# EAGLE design DFPlayer (EAGLE 9.6.2)
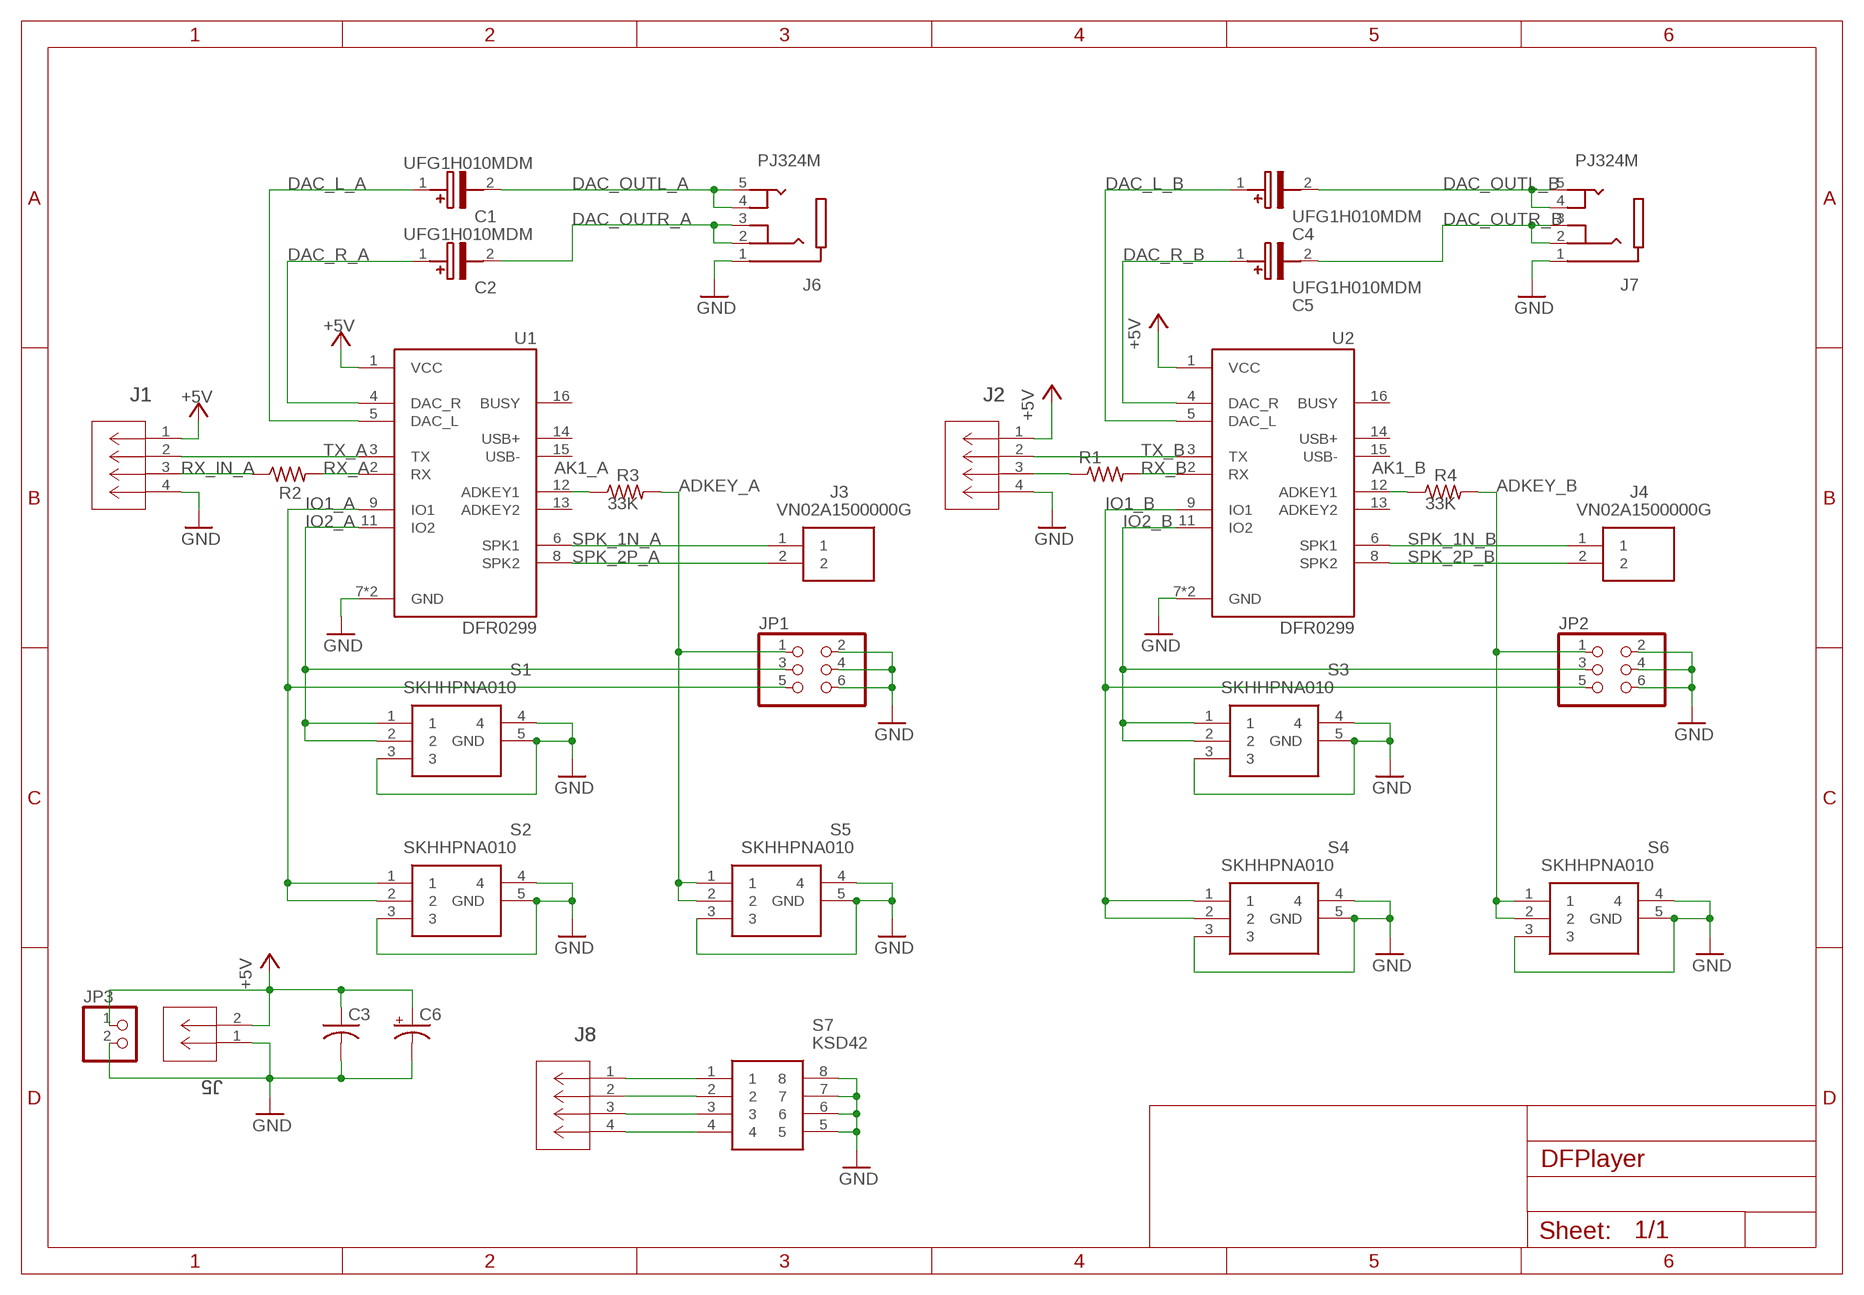
[diagram p0: schematic, sheet 1]

## Parts
C1  UFG1H010MDM  [CAPPRD200W60D550H1250]
C2  UFG1H010MDM  [CAPPRD200W60D550H1250]
C3  C-US025-024X044  [C025-024X044]
C4  UFG1H010MDM  [CAPPRD200W60D550H1250]
C5  UFG1H010MDM  [CAPPRD200W60D550H1250]
C6  CPOL-USB45181A  [B45181A]
J1  S4B-PH-K-S(LF)(SN)  [CONN_S4B-PH-K-S_JST]
J2  S4B-PH-K-S(LF)(SN)  [CONN_S4B-PH-K-S_JST]
J3  VN02A1500000G  [VN02A1500000G]
J4  VN02A1500000G  [VN02A1500000G]
J5  S2B-PH-K-S(LF)(SN)  [CONN_S2B-PH-K-S_JST]
J6  PJ324M  [WENZHOU_PJ324M]
J7  PJ324M  [WENZHOU_PJ324M]
J8  S4B-PH-K-S(LF)(SN)  [CONN_S4B-PH-K-S_JST]
JP1  PINHD-2X3  [2X03]
JP2  PINHD-2X3  [2X03]
JP3  PINHD-1X2  [1X02]
R1  R-US_0204/7  [0204/7]
R2  R-US_0204/7  [0204/7]
R3  R-US_0204/7  [0204/7]
R4  R-US_0204/7  [0204/7]
S1  SKHHPNA010  [SKHHPJA010]
S2  SKHHPNA010  [SKHHPJA010]
S3  SKHHPNA010  [SKHHPJA010]
S4  SKHHPNA010  [SKHHPJA010]
S5  SKHHPNA010  [SKHHPJA010]
S6  SKHHPNA010  [SKHHPJA010]
S7  KSD42  [DIP815W60P254L1210H450Q8N]
U1  DFR0299  [MODULE_DFR0299]
U2  DFR0299  [MODULE_DFR0299]

## Nets
+5V: C3.1 C6.+ J1.1 J2.1 J5.2 JP3.1 U1.1(VCC) U2.1(VCC)
ADKEY_A: JP1.1 R3.2 S5.1 S5.2
ADKEY_B: JP2.1 R4.2 S6.1 S6.2
AK1_A: R3.1 U1.12(ADKEY1)
AK1_B: R4.1 U2.12(ADKEY1)
DAC_L_A: C1.1(+) U1.5(DAC_L)
DAC_L_B: C4.1(+) U2.5(DAC_L)
DAC_OUTL_A: C1.2(-) J6.4(TIP_1) J6.5(TIP_2)
DAC_OUTL_B: C4.2(-) J7.4(TIP_1) J7.5(TIP_2)
DAC_OUTR_A: C2.2(-) J6.2(RING_1) J6.3(RING_2)
DAC_OUTR_B: C5.2(-) J7.2(RING_1) J7.3(RING_2)
DAC_R_A: C2.1(+) U1.4(DAC_R)
DAC_R_B: C5.1(+) U2.4(DAC_R)
GND: C3.2 C6.- J1.4 J2.4 J5.1 J6.1(SLEEVE) J7.1(SLEEVE) JP1.2 JP1.4 JP1.6 JP2.2 JP2.4 JP2.6 JP3.2 S1.3 S1.4 S1.5(GND) S2.3 S2.4 S2.5(GND) S3.3 S3.4 S3.5(GND) S4.3 S4.4 S4.5(GND) S5.3 S5.4 S5.5(GND) S6.3 S6.4 S6.5(GND) S7.5 S7.6 S7.7 S7.8 U1.7(GND) U1.10(GND) U2.7(GND) U2.10(GND)
IO1_A: JP1.5 S2.1 S2.2 U1.9(IO1)
IO1_B: JP2.5 S4.1 S4.2 U2.9(IO1)
IO2_A: JP1.3 S1.1 S1.2 U1.11(IO2)
IO2_B: JP2.3 S3.1 S3.2 U2.11(IO2)
N$1: J8.1 S7.1
N$2: J8.2 S7.2
N$3: J8.3 S7.3
N$4: J8.4 S7.4
N$8: J2.3 R1.1
RX_A: R2.2 U1.2(RX)
RX_B: R1.2 U2.2(RX)
RX_IN_A: J1.3 R2.1
SPK_1N_A: J3.1 U1.6(SPK1)
SPK_1N_B: J4.1 U2.6(SPK1)
SPK_2P_A: J3.2 U1.8(SPK2)
SPK_2P_B: J4.2 U2.8(SPK2)
TX_A: J1.2 U1.3(TX)
TX_B: J2.2 U2.3(TX)
Unconnected: U1.13(ADKEY2) U1.14(USB+) U1.15(USB-) U1.16(BUSY) U2.13(ADKEY2) U2.14(USB+) U2.15(USB-) U2.16(BUSY)

## Library data of the parts
C1 C2 C4 C5 = AU222_F:UFG1H010MDM: Nichicon 1F 50V dc Aluminium Electrolytic Capacitor, Through Hole 5 (Dia.) x 11mm +85C 5mm 2mm Source: Datasheet; DESCRIPTION: Nichicon 1F 50V dc Aluminium Electrolytic Capacitor, Through Hole 5 (Dia.) x 11mm +85C 5mm 2mm; HEIGHT: 12.5mm; MANUFACTURER_NAME: Nichicon; MANUFACTURER_PART_NUMBER: UFG1H010MDM; MOUSER_PART_NUMBER: 647-UFG1H010MDM; MOUSER_PRICE-STOCK: https://www.mouser.co.uk/ProductDetail/Nichicon/UFG1H010MDM?qs=kArNe9LFxXnnZzi8YNJV2w%3D%3D
C3 = AU222_F:C-US: CAPACITOR, American symbol; SPICEPREFIX: C
C6 = AU222_F:CPOL-US: POLARIZED CAPACITOR, American symbol; SPICEPREFIX: C
J1 J2 J8 = AU222_F:S4B-PH-K-S(LF)(SN); COPYRIGHT: Copyright (C) 2024 Ultra Librarian. All rights reserved.; DIGI-KEY_PART_NUMBER_1: 455-1721-ND; DIGI-KEY_PART_NUMBER_2: 455-1721-NDL; MANUFACTURER_PART_NUMBER: S4B-PH-K-S(LF)(SN); MFR_NAME: JST
J3 J4 = AU222_F:VN02A1500000G: 2 Position Wire to Board Terminal Block Horizontal with Board 0.100" (2.54mm) Through Hole Source: Datasheet <http://www.anytek.com.tw/UserUpFiles/20120512/L_wOt9EJEyJN.pdf>; DESCRIPTION: 2 Position Wire to Board Terminal Block Horizontal with Board 0.100" (2.54mm) Through Hole; HEIGHT: 8.8mm; MANUFACTURER_NAME: Amphenol; MANUFACTURER_PART_NUMBER: VN02A1500000G; MOUSER_PART_NUMBER: 649-VN02A15000J0G; MOUSER_PRICE-STOCK: https://www.mouser.co.uk/ProductDetail/Amphenol-Anytek/VN02A1500000G?qs=Mv7BduZupUgf8d3Xo6xdxw%3D%3D
J5 = AU222_F:S2B-PH-K-S(LF)(SN); COPYRIGHT: Copyright (C) 2024 Ultra Librarian. All rights reserved.; DIGI-KEY_PART_NUMBER_1: 455-1719-ND; DIGI-KEY_PART_NUMBER_2: 455-1719-NDL; MANUFACTURER_PART_NUMBER: S2B-PH-K-S(LF)(SN); MFR_NAME: JST
J6 J7 = AU222_F:PJ324M: Headphone Stereo jack/Audio connector Check availability <https://pricing.snapeda.com/parts/PJ324M/Wenzhou%20QingPu%20Electronics%20Co.Ltd/view-part?ref=eda>; AVAILABILITY: Not in stock; CHECK_PRICES: https://www.snapeda.com/parts/PJ324M/Wenzhou+QingPu+Electronics+Co.Ltd/view-part/?ref=eda; DESCRIPTION: Headphone Stereo jack/Audio connector; MF: Wenzhou QingPu Electronics Co.Ltd; MP: PJ324M; PACKAGE: Package; PRICE: None; SNAPEDA_LINK: https://www.snapeda.com/parts/PJ324M/Wenzhou+QingPu+Electronics+Co.Ltd/view-part/?ref=snap
JP1 JP2 = AU222_F:PINHD-2X3: PIN HEADER
JP3 = AU222_F:PINHD-1X2: PIN HEADER
R1-R4 = AU222_F:R-US_: RESISTOR, American symbol; SPICEPREFIX: R
S1-S6 = AU222_F:SKHHPNA010: Black Cap Tactile Switch, SPST-NO 50 mA 5.9mm Snap-In Source: Datasheet <https://www.alps.com/prod/info/E/HTML/Tact/SnapIn/SKHH/SKHHPNA010.html>; DESCRIPTION: Black Cap Tactile Switch, SPST-NO 50 mA 5.9mm Snap-In; HEIGHT: mm; MANUFACTURER_NAME: ALPS Electric; MANUFACTURER_PART_NUMBER: SKHHPNA010; MOUSER_PART_NUMBER: 688-SKHHPN; MOUSER_PRICE-STOCK: https://www.mouser.co.uk/ProductDetail/Alps-Alpine/SKHHPNA010?qs=seHrhfPpLDzVrQJIgDXcJQ%3D%3D
S7 = AU222_F:KSD42: DIP switch K series slide type Source: Datasheet; DESCRIPTION: DIP switch K series slide type; HEIGHT: 4.5mm; MANUFACTURER_NAME: Otax; MANUFACTURER_PART_NUMBER: KSD42
U1 U2 = AU222_F:DFR0299: Dfplayer - a Mini Mp3 Player; AVAILABILITY: Unavailable; DESCRIPTION: Dfplayer - a Mini Mp3 Player; MF: DFRobot; MP: DFR0299; PACKAGE: None; PRICE: None

## Board
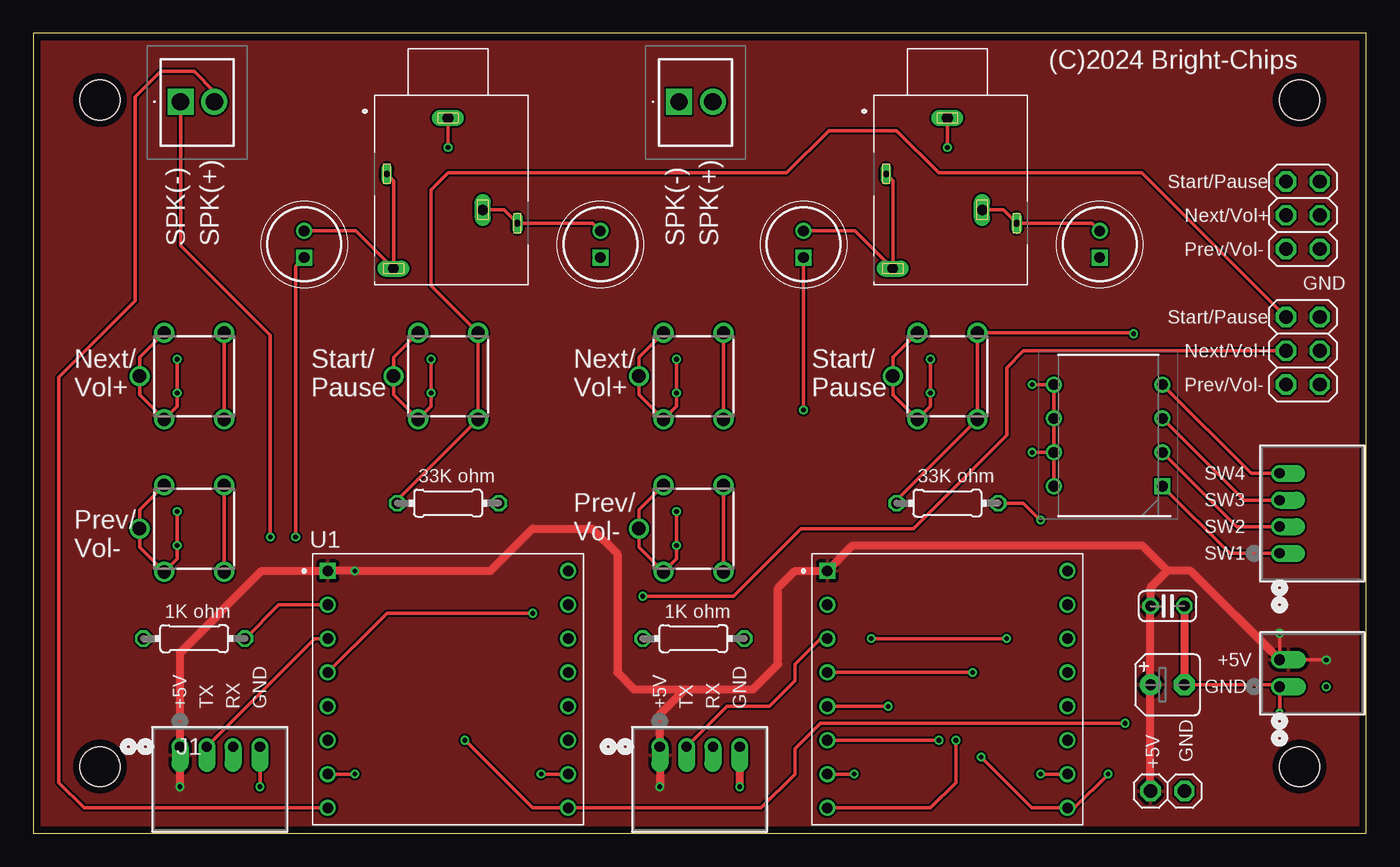
[diagram p1: board, top side]
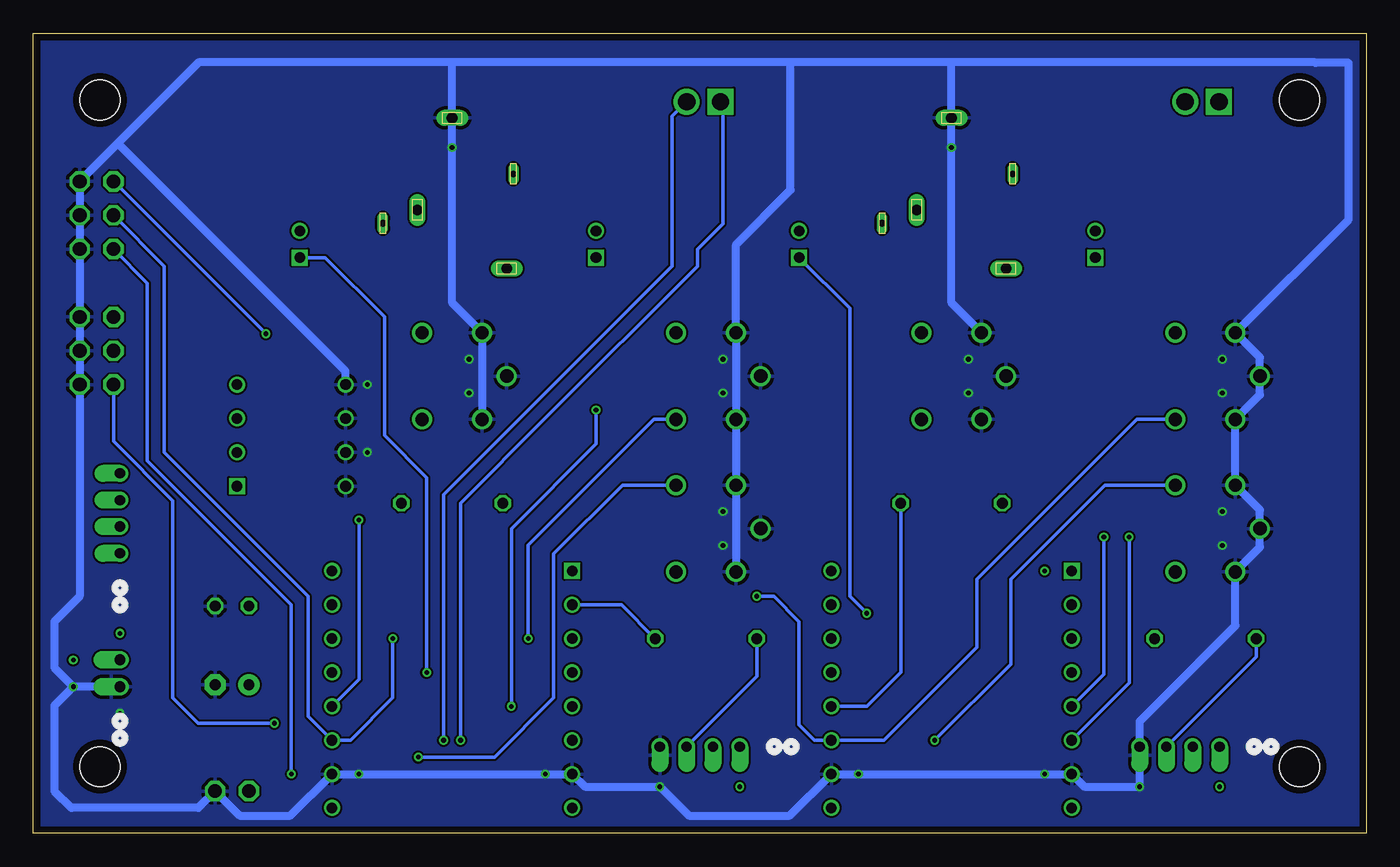
[diagram p2: board, bottom side, seen from below]

Size 100 x 60 mm. Coordinates in mm from the lower left corner, seen from the top.
Outline: 0,0 100,0 100,60 0,60 0,0
Copper layers (1*16): Top 0.035mm / dielectric 1.6mm / Bottom 0.035mm
Design rules "Elecrow_2-layer_PCB_eagle_rule": minimum track width 6mil, minimum drill 12mil, track to track 6mil, track to pad 6mil, pad to pad 6mil, via to via 8mil, smd to smd 0mil, copper to edge 20mil, drill to drill 10mil, minimum pad ring 6mil, minimum via ring 6mil, stop-mask expansion 0mil, vias tented up to drill 100mil, thermal gap 10mil
Holes 3 mm at 5,5 5,55 95,55 95,5

### Footprints (pad centres in the part's own frame; a part is rotated, then mirrored left to right if it is on the bottom)
CAPPRD200W60D550H1250 = drill 0.8 pad 1.2 square: 1 0,0 | drill 0.8 pad 1.2: 2 2,0
C025-024X044 = drill 0.813 octagon: 1 -1.27,0; 2 1.27,0
B45181A = drill 0.813 pad 1.6: + -1.27,0 | drill 0.813 pad 1.6 octagon: - 1.27,0
CONN_S4B-PH-K-S_JST = drill 0.762 pad 1.27 offset: 1 0,0; 2 2.007,0; 3 3.988,0; 4 5.994,0
VN02A1500000G = drill 1.3 pad 1.95 square: 1 0,0 | drill 1.3 pad 1.95: 2 2.54,0
CONN_S2B-PH-K-S_JST = drill 0.813 pad 1.321 offset: 1 0,0; 2 2.007,0
WENZHOU_PJ324M = drill 0.8 long: 1 0,5.4; 3 2.6,-1.5; 4 -4.1,-5.9 | drill 0.5 long: 2 5.2,-2.5; 5 -4.6,1.2
2X03 = drill 1.016 octagon: 1 -2.54,-1.27; 2 -2.54,1.27; 3 0,-1.27; 4 0,1.27; 5 2.54,-1.27; 6 2.54,1.27
1X02 = drill 1.016 octagon: 1 -1.27,0; 2 1.27,0
0204/7 = drill 0.813 octagon: 1 -3.81,0; 2 3.81,0
SKHHPJA010 = drill 1 pad 1.5: 1 -3.25,2.25; 2 3.25,2.25; 3 -3.25,-2.25; 4 3.25,-2.25; 5 0,-4.1
DIP815W60P254L1210H450Q8N = drill 0.8 pad 1.2 square: 1 -4.075,3.81 | drill 0.8 pad 1.2: 2 -4.075,1.27; 3 -4.075,-1.27; 4 -4.075,-3.81; 5 4.075,-3.81; 6 4.075,-1.27; 7 4.075,1.27; 8 4.075,3.81
MODULE_DFR0299 = drill 0.8 square: 1 -9.017,8.89 | drill 0.8: 2 -9.017,6.35; 3 -9.017,3.81; 4 -9.017,1.27; 5 -9.017,-1.27; 6 -9.017,-3.81; 7 -9.017,-6.35; 8 -9.017,-8.89; 9 9.017,-8.89; 10 9.017,-6.35; 11 9.017,-3.81; 12 9.017,-1.27; 13 9.017,1.27; 14 9.017,3.81; 15 9.017,6.35; 16 9.017,8.89

### Placement (x,y rotation side)
C1  20.32,43.18 90 top
C2  42.55,43.18 90 top
C3  85.09,17.05 0 top
C4  57.78,43.18 90 top
C5  80.01,43.18 90 top
C6  85.09,11.14 0 top
J1  11,6.5 0 top
J2  47,6.5 0 top
J3  11.04,54.87 0 top
J4  48.44,54.87 0 top
J5  93.5,11 90 top
J6  31.11,48.26 0 top
J7  68.58,48.26 0 top
J8  93.5,21 90 top
JP1  95.25,36.2 270 top
JP2  95.25,46.35 270 top
JP3  85.09,3.17 0 top
R1  49.53,14.61 0 top
R2  12.06,14.61 0 top
R3  31.11,24.77 180 top
R4  68.58,24.77 180 top
S1  12.06,34.29 270 top
S2  12.06,22.86 270 top
S3  49.53,34.29 270 top
S4  49.53,22.86 270 top
S5  31.11,34.29 270 top
S6  68.58,34.29 270 top
S7  80.64,29.84 180 top
U1  31.11,10.79 0 top
U2  68.58,10.79 0 top

### Tracks (layer width: path | path; a pad name or v marks a point on that pad's centre or on a via)
+5V  (via drill 0.35)
  Top 0.254: v97,13 v96.99,13.01 J5.2 v93.5,15
  Top 0.61: v11,3.5 J1.1 11,13.54 17.14,19.68 U1.1 v24.13,19.68 34.29,19.68 37.47,22.86 41.91,22.86 43.81,20.95 43.81,12.06 45.09,10.79 48.9,10.79 | 48.9,10.79 46.99,8.89 47,8.88 J2.1 v47,3.5 | 48.9,10.79 53.98,10.79 55.88,12.7 55.88,18.41 57.15,19.68 U2.1 61.47,21.59 83.19,21.59 85.09,19.68 | JP3.1 C6.+ C3.1 83.82,18.41 85.09,19.68 | J5.2 86.82,19.68 85.09,19.68
  pour Top: 0.5,59.5 0.5,0.5 99.5,0.5 99.5,59.5
ADKEY_A
  Top 0.254: R3.2 27.3,24.98 S5.2 S5.1 29.84,41.06 29.84,48.26 31.11,49.53 56.52,49.53 59.69,52.7 64.77,52.7 67.94,49.53 83.19,49.53 JP1.1
ADKEY_B  (via drill 0.35)
  Top 0.254: R4.2 64.77,24.98 S6.2 S6.1 82.47,37.54 v82.55,37.47
  Bottom 0.254: v82.55,37.47 JP2.1
AK1_A
  Bottom 0.254: R3.1 34.92,12.06 37.47,9.53 U1.12
AK1_B  (via drill 0.35)
  Top 0.254: R4.1 74.3,24.77 v75.56,23.5
  Bottom 0.254: U2.12 75.56,11.56 v75.56,23.5
DAC_L_A  (via drill 0.35)
  Top 0.254: v19.68,22.23 19.68,42.55 C1.1
  Bottom 0.254: U1.5 19.68,11.94 v19.68,22.23
DAC_L_B  (via drill 0.35)
  Top 0.254: C4.1 v57.78,31.75 | U2.5 v64.14,9.53
  Bottom 0.254: v64.14,9.53 64.14,22.86 57.78,29.21 v57.78,31.75
DAC_OUTL_A
  Top 0.254: J6.5 27.02,48.96 J6.4 24.2,45.18 C1.2
DAC_OUTL_B
  Top 0.254: C4.2 61.66,45.18 J7.4 64.48,48.96 J7.5
DAC_OUTR_A
  Top 0.254: J6.3 35.31,46.76 J6.2 41.97,45.76 C2.2
DAC_OUTR_B
  Top 0.254: J7.3 72.78,46.76 J7.2 79.43,45.76 C5.2
DAC_R_A  (via drill 0.35)
  Top 0.254: U1.4 25.91,15.88 26.54,16.51 v37.47,16.51
  Bottom 0.254: v37.47,16.51 38.73,17.78 38.73,39.37 C2.1
DAC_R_B  (via drill 0.35)
  Top 0.254: U2.4 v70.48,12.06
  Bottom 0.254: v70.48,12.06 70.48,26.67 73.66,29.84 73.66,38.73 78.11,43.18 C5.1
GND  (via drill 0.35)
  Top 0.254: S1.3 7.96,35.69 S1.5 7.96,32.89 S1.4 10.79,32.02 v10.79,33.02 v10.79,35.56 | S2.3 7.96,24.26 S2.5 7.96,21.46 S2.4 10.79,20.59 v10.79,21.59 v10.79,24.13 | S5.3 27.02,35.69 S5.5 27.02,32.89 S5.4 29.84,32.02 v29.84,33.02 v29.84,35.56 | S3.3 45.43,35.69 S3.5 45.43,32.89 S3.4 48.26,32.02 v48.26,33.02 v48.26,35.56 | S4.3 45.43,24.26 S4.5 45.43,21.46 S4.4 48.26,20.59 v48.26,21.59 v48.26,24.13 | J1.4 v17,3.5 | U1.7 v24.13,4.45 | U1.10 v38.1,4.45 | v61.59,4.45 U2.7 | U2.10 v75.56,4.45 | J6.1 v31.11,51.44 | J7.1 v68.58,51.44 | v74.93,33.66 S7.5 S7.6 S7.7 | S7.7 S7.8 | S7.7 v74.93,28.57 | S6.3 64.48,35.69 S6.5 64.48,32.89 S6.4 67.31,32.02 v67.31,33.02 v67.31,35.56 | v93.5,9 J5.1 93.36,11.14 C6.-
  Top 0.61: v53,3.5 J2.4 | C3.2 C6.-
  Bottom 0.61: v97,11 98.42,12.43 98.42,15.88 96.52,17.78 JP1.6 JP1.4 JP1.2 JP2.6 JP2.4 JP2.2 93.66,51.75 | v97,11 98.42,9.57 98.42,3.17 97.16,1.91 87.63,1.91 JP3.2 84.51,1.32 80.72,1.32 U2.10 v75.56,4.45 v61.59,4.45 U2.7 58.62,3.5 v53,3.5 50.82,1.32 43.26,1.32 U1.10 v38.1,4.45 v24.13,4.45 U1.7 21.15,3.5 v17,3.5 J1.4 16.99,8.41 9.81,15.59 S2.4 7.96,21.46 S2.5 7.96,24.26 S2.3 S1.4 7.96,32.89 S1.5 7.96,35.69 S1.3 1.32,46.03 1.32,57.78 3.8,57.78 3.83,57.82 31.11,57.82 | 31.11,57.82 43.18,57.82 | 43.18,57.82 68.58,57.82 | 68.58,57.82 87.59,57.82 93.66,51.75 | S5.3 31.11,39.79 v31.11,51.44 J6.1 31.11,57.82 | 68.58,57.82 J7.1 v68.58,51.44 68.58,39.79 S6.3 S6.4 | S7.5 76.57,34.66 93.66,51.75 | 43.18,57.82 43.18,48.26 47.28,44.16 S3.3 S3.4 S4.3 S4.4 | J5.1 v97,11
  pour Bottom: 0.5,59.5 0.5,0.5 99.5,0.5 99.5,59.5
IO1_A  (via drill 0.35)
  Top 0.254: S2.1 S2.2 | v32.38,6.99 37.47,1.91 U1.9 54.61,1.91 57.15,4.45 57.15,6.35 59.05,8.26 v81.92,8.26
  Bottom 0.254: v32.38,6.99 26.67,12.7 26.67,19.05 19.61,26.11 S2.1 | v81.92,8.26 87.63,8.26 89.53,10.16 89.53,24.96 93.98,29.4 JP1.5
IO1_B  (via drill 0.35)
  Top 0.254: S4.1 S4.2 | v80.64,4.45 78.11,1.91 U2.9 74.93,1.91 v71.12,5.71
  Bottom 0.254: v80.64,4.45 80.64,17.14 91.44,27.94 91.44,41.27 JP2.5 | v71.12,5.71 65.41,5.71 60.96,10.16 60.96,20.95 55.8,26.11 S4.1
IO2_A  (via drill 0.35)
  Top 0.254: S1.1 S1.2 | JP1.3 74.3,36.2 73.03,34.92 73.03,29.84 66.04,22.86 57.59,22.86 52.51,17.78 v45.72,17.78
  Bottom 0.254: S1.2 17.22,31.04 29.21,19.05 29.21,13.97 36.2,6.99 U1.11 41.4,6.99 42.55,8.13 42.55,15.88 44.45,17.78 v45.72,17.78
IO2_B  (via drill 0.35)
  Top 0.254: S3.1 S3.2 | v62.87,14.61 v73.03,14.61
  Bottom 0.254: JP2.3 90.17,42.55 90.17,28.57 79.38,17.78 79.38,8.76 U2.11 76.2,6.99 73.03,10.16 v73.03,14.61 | v62.87,14.61 62.87,21.59 53.41,31.04 S3.2
N$1
  Top 0.254: S7.1 89.75,21 J8.1
N$2
  Top 0.254: S7.2 90.29,23.01 J8.2
N$3
  Top 0.254: S7.3 90.85,24.99 J8.3
N$4
  Top 0.254: S7.4 91.38,26.99 J8.4
N$8
  Bottom 0.254: J2.3 45.72,11.77 R1.1
RX_A
  Top 0.254: R2.2 18.41,17.14 U1.2
RX_B
  Bottom 0.254: R1.2 55.88,17.14 U2.2
RX_IN_A
  Bottom 0.254: J1.3 8.26,13.23 R2.1
SPK_1N_A  (via drill 0.35)
  Top 0.254: J3.1 11.04,44.08 17.78,37.34 v17.78,22.23
  Bottom 0.254: U1.6 17.78,11.3 v17.78,22.23
SPK_1N_B  (via drill 0.35)
  Top 0.254: U2.6 v67.94,6.99
  Bottom 0.254: v67.94,6.99 67.94,24.77 61.59,31.11 50.16,42.55 50.16,43.81 48.26,45.72 48.26,54.69 J4.1
SPK_2P_A
  Top 0.254: U1.8 3.81,1.91 1.91,3.81 1.91,34.2 7.64,39.94 7.64,55.24 9.55,57.15 12.06,57.15 13.59,55.63 J3.2
SPK_2P_B  (via drill 0.35)
  Top 0.254: U2.8 67.31,1.91 69.22,3.81 v69.22,6.99
  Bottom 0.254: v69.22,6.99 69.22,25.4 52.07,42.55 52.07,53.78 J4.2
TX_A
  Top 0.254: J1.2 21.11,14.61 U1.3
TX_B
  Top 0.254: J2.2 52.03,9.53 55.24,9.53 57.15,11.43 57.15,12.7 59.05,14.61 U2.3

### Text on the board
tPlace: (C)2024 Bright-Chips | Start/Pause | Next/Vol+ | SPK(-) | SPK(+) | SPK(-) | SPK(+) | Prev/Vol- | GND | Start/Pause | Next/Vol+ | Next/ / Vol+ | Start/ / Pause | Next/ / Vol+ | Start/ / Pause | Prev/Vol- | 33K ohm | 33K ohm | SW4 | SW3 | Prev/ / Vol- | SW2 | Prev/ / Vol- | SW1 | 1K ohm | 1K ohm | +5V | GND | +5V | TX | RX | GND | +5V | TX | RX | GND | +5V | GND